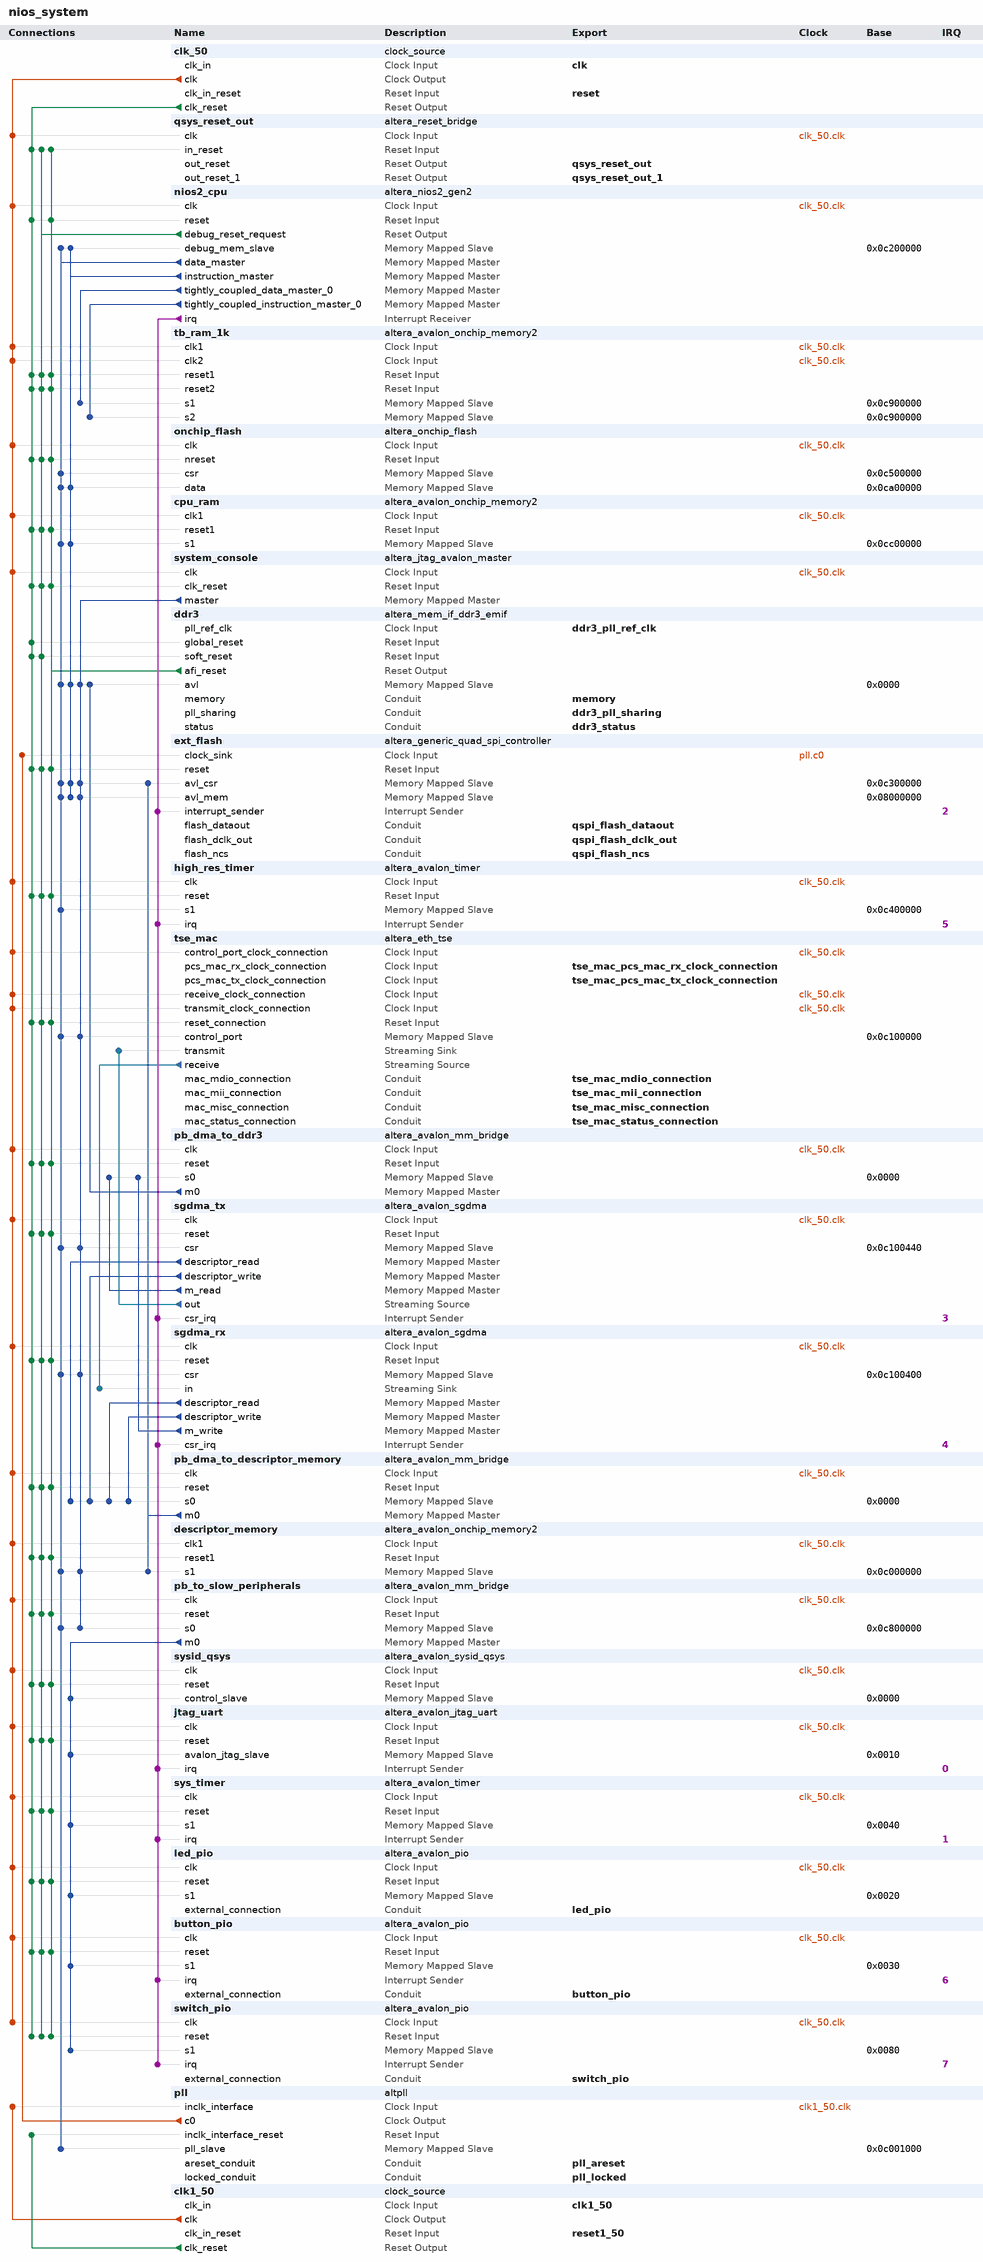
[diagram p0: system contents]
# Platform Designer (Qsys) system nios_system, MAX 10 10M50DAF484C6GES
# Parameters at their usual value, and those the tool derives, are not listed.
package require -exact qsys 16.0
create_system nios_system
set_project_property DEVICE_FAMILY {MAX 10}
set_project_property DEVICE 10M50DAF484C6GES

add_instance clk_50 clock_source 16.0
set_instance_parameter_value clk_50 clockFrequency 50000000

add_instance qsys_reset_out altera_reset_bridge 16.0
set_instance_parameter_value qsys_reset_out ACTIVE_LOW_RESET 1
set_instance_parameter_value qsys_reset_out NUM_RESET_OUTPUTS 2
set_instance_parameter_value qsys_reset_out SYNCHRONOUS_EDGES deassert

add_instance nios2_cpu altera_nios2_gen2 16.0
set_instance_parameter_value nios2_cpu dcache_numTCDM 1
set_instance_parameter_value nios2_cpu dcache_size 16384
set_instance_parameter_value nios2_cpu debug_datatrigger 2
set_instance_parameter_value nios2_cpu debug_hwbreakpoint 2
set_instance_parameter_value nios2_cpu debug_traceType instruction_and_data_trace
set_instance_parameter_value nios2_cpu dividerType srt2
set_instance_parameter_value nios2_cpu exceptionSlave ddr3.avl
set_instance_parameter_value nios2_cpu icache_numTCIM 1
set_instance_parameter_value nios2_cpu icache_size 32768
set_instance_parameter_value nios2_cpu impl Fast
set_instance_parameter_value nios2_cpu io_regionbase -536870912
set_instance_parameter_value nios2_cpu io_regionsize 536870912
set_instance_parameter_value nios2_cpu mmu_TLBMissExcOffset 256
set_instance_parameter_value nios2_cpu mmu_TLBMissExcSlave tb_ram_1k.s2
set_instance_parameter_value nios2_cpu mmu_enabled true
set_instance_parameter_value nios2_cpu resetSlave ext_flash.avl_mem
set_instance_parameter_value nios2_cpu setting_preciseIllegalMemAccessException true

add_instance tb_ram_1k altera_avalon_onchip_memory2 16.0
set_instance_parameter_value tb_ram_1k dataWidth 32
set_instance_parameter_value tb_ram_1k dualPort true
set_instance_parameter_value tb_ram_1k initMemContent false
set_instance_parameter_value tb_ram_1k initializationFileName onchip_mem.hex
set_instance_parameter_value tb_ram_1k memorySize 1024

add_instance onchip_flash altera_onchip_flash 16.0
set_instance_parameter_value onchip_flash CONFIGURATION_MODE {Single Compressed Image with Memory Initialization}
set_instance_parameter_value onchip_flash SECTOR_ACCESS_MODE {Read and write,Read and write,Hidden,Hidden,Hidden}
set_instance_parameter_value onchip_flash initFlashContent false
set_instance_parameter_value onchip_flash initializationFileName "C:\\Altera\\DevKits\\DECA_Max10\\Max10_ddr\\software\\an458_adv_boot_copier\\mem_init\\onchip_flash.hex"
set_instance_parameter_value onchip_flash useNonDefaultInitFile true

add_instance cpu_ram altera_avalon_onchip_memory2 16.0
set_instance_parameter_value cpu_ram dataWidth 32
set_instance_parameter_value cpu_ram dualPort false
set_instance_parameter_value cpu_ram initMemContent false
set_instance_parameter_value cpu_ram initializationFileName onchip_mem.hex
set_instance_parameter_value cpu_ram memorySize 49152

add_instance system_console altera_jtag_avalon_master 16.0

add_instance ddr3 altera_mem_if_ddr3_emif 16.0
set_instance_parameter_value ddr3 AVL_MAX_SIZE 4
set_instance_parameter_value ddr3 CALIBRATION_MODE Skip
set_instance_parameter_value ddr3 CPORT_TYPE_PORT Bidirectional,Bidirectional,Bidirectional,Bidirectional,Bidirectional,Bidirectional
set_instance_parameter_value ddr3 EXPORT_AFI_HALF_CLK false
set_instance_parameter_value ddr3 HARD_EMIF false
set_instance_parameter_value ddr3 MEM_BANKADDR_WIDTH 3
set_instance_parameter_value ddr3 MEM_CLK_FREQ 300.0
set_instance_parameter_value ddr3 MEM_CLK_FREQ_MAX 800.0
set_instance_parameter_value ddr3 MEM_COL_ADDR_WIDTH 10
set_instance_parameter_value ddr3 MEM_DQ_WIDTH 16
set_instance_parameter_value ddr3 MEM_FORMAT DISCRETE
set_instance_parameter_value ddr3 MEM_ROW_ADDR_WIDTH 13
set_instance_parameter_value ddr3 MEM_TCL 7
set_instance_parameter_value ddr3 MEM_TFAW_NS 45.0
set_instance_parameter_value ddr3 MEM_TRAS_NS 35.0
set_instance_parameter_value ddr3 MEM_TRCD_NS 13.75
set_instance_parameter_value ddr3 MEM_TRFC_NS 260.0
set_instance_parameter_value ddr3 MEM_TRP_NS 13.75
set_instance_parameter_value ddr3 MEM_TRRD_NS 7.5
set_instance_parameter_value ddr3 MEM_TRTP_NS 7.5
set_instance_parameter_value ddr3 MEM_TWTR 6
set_instance_parameter_value ddr3 MEM_VENDOR Micron
set_instance_parameter_value ddr3 MEM_VERBOSE false
set_instance_parameter_value ddr3 MEM_WTCL 6
set_instance_parameter_value ddr3 PLL_LOCATION Top_Bottom
set_instance_parameter_value ddr3 POWER_OF_TWO_BUS true
set_instance_parameter_value ddr3 PRIORITY_PORT 1,1,1,1,1,1
set_instance_parameter_value ddr3 RATE Half
set_instance_parameter_value ddr3 REF_CLK_FREQ 50.0
set_instance_parameter_value ddr3 SPEED_GRADE 6
set_instance_parameter_value ddr3 TIMING_BOARD_AC_SKEW 0.017
set_instance_parameter_value ddr3 TIMING_BOARD_AC_TO_CK_SKEW -1.3E-4
set_instance_parameter_value ddr3 TIMING_BOARD_DQ_TO_DQS_SKEW -6.0E-4
set_instance_parameter_value ddr3 TIMING_BOARD_MAX_CK_DELAY 0.183
set_instance_parameter_value ddr3 TIMING_BOARD_MAX_DQS_DELAY 0.181
set_instance_parameter_value ddr3 TIMING_BOARD_SKEW_BETWEEN_DQS 0.005
set_instance_parameter_value ddr3 TIMING_BOARD_SKEW_CKDQS_DIMM_MAX 0.007
set_instance_parameter_value ddr3 TIMING_BOARD_SKEW_CKDQS_DIMM_MIN 0.002
set_instance_parameter_value ddr3 TIMING_BOARD_SKEW_WITHIN_DQS 0.008
set_instance_parameter_value ddr3 TIMING_TDH 55
set_instance_parameter_value ddr3 TIMING_TDQSCK 225
set_instance_parameter_value ddr3 TIMING_TDQSQ 125
set_instance_parameter_value ddr3 TIMING_TDQSS 0.25
set_instance_parameter_value ddr3 TIMING_TDS 55
set_instance_parameter_value ddr3 TIMING_TDSH 0.2
set_instance_parameter_value ddr3 TIMING_TDSS 0.2
set_instance_parameter_value ddr3 TIMING_TIH 130
set_instance_parameter_value ddr3 TIMING_TIS 185
set_instance_parameter_value ddr3 TIMING_TQSH 0.4
set_instance_parameter_value ddr3 USER_DEBUG_LEVEL 1

add_instance ext_flash altera_generic_quad_spi_controller 16.0
set_instance_parameter_value ext_flash CHIP_SELS 1
set_instance_parameter_value ext_flash FLASH_TYPE Micron512
set_instance_parameter_value ext_flash IO_MODE QUAD
set_instance_parameter_value ext_flash clkFreq 25000000

add_instance high_res_timer altera_avalon_timer 16.0
set_instance_parameter_value high_res_timer period 1
set_instance_parameter_value high_res_timer periodUnits USEC

add_instance tse_mac altera_eth_tse 16.0
set_instance_parameter_value tse_mac core_variation SMALL_MAC_10_100
set_instance_parameter_value tse_mac enable_hd_logic true
set_instance_parameter_value tse_mac enable_mac_flow_ctrl false
set_instance_parameter_value tse_mac enable_magic_detect false
set_instance_parameter_value tse_mac enable_shift16 true
set_instance_parameter_value tse_mac ifGMII MII
set_instance_parameter_value tse_mac ing_addr 11
set_instance_parameter_value tse_mac mdio_clk_div 40
set_instance_parameter_value tse_mac stat_cnt_ena false
set_instance_parameter_value tse_mac transceiver_type NONE

add_instance pb_dma_to_ddr3 altera_avalon_mm_bridge 16.0
set_instance_parameter_value pb_dma_to_ddr3 ADDRESS_UNITS SYMBOLS
set_instance_parameter_value pb_dma_to_ddr3 ADDRESS_WIDTH 28
set_instance_parameter_value pb_dma_to_ddr3 DATA_WIDTH 32
set_instance_parameter_value pb_dma_to_ddr3 MAX_PENDING_RESPONSES 4
set_instance_parameter_value pb_dma_to_ddr3 USE_AUTO_ADDRESS_WIDTH 0

add_instance sgdma_tx altera_avalon_sgdma 16.0
set_instance_parameter_value sgdma_tx enableBurstTransfers false
set_instance_parameter_value sgdma_tx enableUnalignedTransfers true
set_instance_parameter_value sgdma_tx readBlockDataWidth 32
set_instance_parameter_value sgdma_tx sinkErrorWidth 0
set_instance_parameter_value sgdma_tx sourceErrorWidth 1
set_instance_parameter_value sgdma_tx transferMode MEMORY_TO_STREAM
set_instance_parameter_value sgdma_tx writeBurstcountWidth 4

add_instance sgdma_rx altera_avalon_sgdma 16.0
set_instance_parameter_value sgdma_rx enableBurstTransfers false
set_instance_parameter_value sgdma_rx enableUnalignedTransfers true
set_instance_parameter_value sgdma_rx readBlockDataWidth 32
set_instance_parameter_value sgdma_rx sinkErrorWidth 6
set_instance_parameter_value sgdma_rx sourceErrorWidth 0
set_instance_parameter_value sgdma_rx transferMode STREAM_TO_MEMORY
set_instance_parameter_value sgdma_rx writeBurstcountWidth 4

add_instance pb_dma_to_descriptor_memory altera_avalon_mm_bridge 16.0
set_instance_parameter_value pb_dma_to_descriptor_memory ADDRESS_UNITS SYMBOLS
set_instance_parameter_value pb_dma_to_descriptor_memory ADDRESS_WIDTH 31
set_instance_parameter_value pb_dma_to_descriptor_memory DATA_WIDTH 32
set_instance_parameter_value pb_dma_to_descriptor_memory MAX_PENDING_RESPONSES 4
set_instance_parameter_value pb_dma_to_descriptor_memory USE_AUTO_ADDRESS_WIDTH 0

add_instance descriptor_memory altera_avalon_onchip_memory2 16.0
set_instance_parameter_value descriptor_memory dataWidth 32
set_instance_parameter_value descriptor_memory dualPort false
set_instance_parameter_value descriptor_memory initMemContent false
set_instance_parameter_value descriptor_memory initializationFileName onchip_mem.hex
set_instance_parameter_value descriptor_memory memorySize 4096

add_instance pb_to_slow_peripherals altera_avalon_mm_bridge 16.0
set_instance_parameter_value pb_to_slow_peripherals ADDRESS_UNITS SYMBOLS
set_instance_parameter_value pb_to_slow_peripherals ADDRESS_WIDTH 12
set_instance_parameter_value pb_to_slow_peripherals DATA_WIDTH 32
set_instance_parameter_value pb_to_slow_peripherals MAX_PENDING_RESPONSES 4
set_instance_parameter_value pb_to_slow_peripherals USE_AUTO_ADDRESS_WIDTH 0

add_instance sysid_qsys altera_avalon_sysid_qsys 16.0
set_instance_parameter_value sysid_qsys id 57034

add_instance jtag_uart altera_avalon_jtag_uart 16.0
set_instance_parameter_value jtag_uart simInteractiveOptions NO_INTERACTIVE_WINDOWS

add_instance sys_timer altera_avalon_timer 16.0
set_instance_parameter_value sys_timer period 1
set_instance_parameter_value sys_timer periodUnits MSEC

add_instance led_pio altera_avalon_pio 16.0
set_instance_parameter_value led_pio direction Output
set_instance_parameter_value led_pio width 8

add_instance button_pio altera_avalon_pio 16.0
set_instance_parameter_value button_pio bitClearingEdgeCapReg true
set_instance_parameter_value button_pio captureEdge true
set_instance_parameter_value button_pio direction Input
set_instance_parameter_value button_pio generateIRQ true
set_instance_parameter_value button_pio irqType EDGE
set_instance_parameter_value button_pio simDoTestBenchWiring true
set_instance_parameter_value button_pio width 8

add_instance switch_pio altera_avalon_pio 16.0
set_instance_parameter_value switch_pio bitClearingEdgeCapReg true
set_instance_parameter_value switch_pio captureEdge true
set_instance_parameter_value switch_pio direction Input
set_instance_parameter_value switch_pio generateIRQ true
set_instance_parameter_value switch_pio irqType EDGE
set_instance_parameter_value switch_pio simDoTestBenchWiring true
set_instance_parameter_value switch_pio width 8

add_instance pll altpll 16.0
set_instance_parameter_value pll CLK0_DIVIDE_BY 2
set_instance_parameter_value pll CLK0_MULTIPLY_BY 1
set_instance_parameter_value pll INCLK0_INPUT_FREQUENCY 20000
set_instance_parameter_value pll PORT_ARESET PORT_USED
set_instance_parameter_value pll PORT_LOCKED PORT_USED
set_instance_parameter_value pll PORT_clk1 PORT_UNUSED
set_instance_parameter_value pll PORT_clk2 PORT_UNUSED
set_instance_parameter_value pll PORT_clk3 PORT_UNUSED

add_instance clk1_50 clock_source 16.0
set_instance_parameter_value clk1_50 clockFrequency 50000000

# connections
add_connection clk1_50.clk pll.inclk_interface clock
add_connection clk_50.clk button_pio.clk clock
add_connection clk_50.clk cpu_ram.clk1 clock
add_connection clk_50.clk descriptor_memory.clk1 clock
add_connection clk_50.clk high_res_timer.clk clock
add_connection clk_50.clk jtag_uart.clk clock
add_connection clk_50.clk led_pio.clk clock
add_connection clk_50.clk nios2_cpu.clk clock
add_connection clk_50.clk onchip_flash.clk clock
add_connection clk_50.clk pb_dma_to_ddr3.clk clock
add_connection clk_50.clk pb_dma_to_descriptor_memory.clk clock
add_connection clk_50.clk pb_to_slow_peripherals.clk clock
add_connection clk_50.clk qsys_reset_out.clk clock
add_connection clk_50.clk sgdma_rx.clk clock
add_connection clk_50.clk sgdma_tx.clk clock
add_connection clk_50.clk switch_pio.clk clock
add_connection clk_50.clk sys_timer.clk clock
add_connection clk_50.clk sysid_qsys.clk clock
add_connection clk_50.clk system_console.clk clock
add_connection clk_50.clk tb_ram_1k.clk1 clock
add_connection clk_50.clk tb_ram_1k.clk2 clock
add_connection clk_50.clk tse_mac.control_port_clock_connection clock
add_connection clk_50.clk tse_mac.receive_clock_connection clock
add_connection clk_50.clk tse_mac.transmit_clock_connection clock
add_connection pll.c0 ext_flash.clock_sink clock
add_connection clk1_50.clk_reset pll.inclk_interface_reset reset
add_connection clk_50.clk_reset button_pio.reset reset
add_connection clk_50.clk_reset cpu_ram.reset1 reset
add_connection clk_50.clk_reset ddr3.global_reset reset
add_connection clk_50.clk_reset ddr3.soft_reset reset
add_connection clk_50.clk_reset descriptor_memory.reset1 reset
add_connection clk_50.clk_reset ext_flash.reset reset
add_connection clk_50.clk_reset high_res_timer.reset reset
add_connection clk_50.clk_reset jtag_uart.reset reset
add_connection clk_50.clk_reset led_pio.reset reset
add_connection clk_50.clk_reset nios2_cpu.reset reset
add_connection clk_50.clk_reset onchip_flash.nreset reset
add_connection clk_50.clk_reset pb_dma_to_ddr3.reset reset
add_connection clk_50.clk_reset pb_dma_to_descriptor_memory.reset reset
add_connection clk_50.clk_reset pb_to_slow_peripherals.reset reset
add_connection clk_50.clk_reset qsys_reset_out.in_reset reset
add_connection clk_50.clk_reset sgdma_rx.reset reset
add_connection clk_50.clk_reset sgdma_tx.reset reset
add_connection clk_50.clk_reset switch_pio.reset reset
add_connection clk_50.clk_reset sys_timer.reset reset
add_connection clk_50.clk_reset sysid_qsys.reset reset
add_connection clk_50.clk_reset system_console.clk_reset reset
add_connection clk_50.clk_reset tb_ram_1k.reset1 reset
add_connection clk_50.clk_reset tb_ram_1k.reset2 reset
add_connection clk_50.clk_reset tse_mac.reset_connection reset
add_connection ddr3.afi_reset button_pio.reset reset
add_connection ddr3.afi_reset cpu_ram.reset1 reset
add_connection ddr3.afi_reset descriptor_memory.reset1 reset
add_connection ddr3.afi_reset ext_flash.reset reset
add_connection ddr3.afi_reset high_res_timer.reset reset
add_connection ddr3.afi_reset jtag_uart.reset reset
add_connection ddr3.afi_reset led_pio.reset reset
add_connection ddr3.afi_reset nios2_cpu.reset reset
add_connection ddr3.afi_reset onchip_flash.nreset reset
add_connection ddr3.afi_reset pb_dma_to_ddr3.reset reset
add_connection ddr3.afi_reset pb_dma_to_descriptor_memory.reset reset
add_connection ddr3.afi_reset pb_to_slow_peripherals.reset reset
add_connection ddr3.afi_reset qsys_reset_out.in_reset reset
add_connection ddr3.afi_reset sgdma_rx.reset reset
add_connection ddr3.afi_reset sgdma_tx.reset reset
add_connection ddr3.afi_reset switch_pio.reset reset
add_connection ddr3.afi_reset sys_timer.reset reset
add_connection ddr3.afi_reset sysid_qsys.reset reset
add_connection ddr3.afi_reset system_console.clk_reset reset
add_connection ddr3.afi_reset tb_ram_1k.reset1 reset
add_connection ddr3.afi_reset tb_ram_1k.reset2 reset
add_connection ddr3.afi_reset tse_mac.reset_connection reset
add_connection nios2_cpu.debug_reset_request button_pio.reset reset
add_connection nios2_cpu.debug_reset_request cpu_ram.reset1 reset
add_connection nios2_cpu.debug_reset_request ddr3.soft_reset reset
add_connection nios2_cpu.debug_reset_request descriptor_memory.reset1 reset
add_connection nios2_cpu.debug_reset_request ext_flash.reset reset
add_connection nios2_cpu.debug_reset_request high_res_timer.reset reset
add_connection nios2_cpu.debug_reset_request jtag_uart.reset reset
add_connection nios2_cpu.debug_reset_request led_pio.reset reset
add_connection nios2_cpu.debug_reset_request onchip_flash.nreset reset
add_connection nios2_cpu.debug_reset_request pb_dma_to_ddr3.reset reset
add_connection nios2_cpu.debug_reset_request pb_dma_to_descriptor_memory.reset reset
add_connection nios2_cpu.debug_reset_request pb_to_slow_peripherals.reset reset
add_connection nios2_cpu.debug_reset_request qsys_reset_out.in_reset reset
add_connection nios2_cpu.debug_reset_request sgdma_rx.reset reset
add_connection nios2_cpu.debug_reset_request sgdma_tx.reset reset
add_connection nios2_cpu.debug_reset_request switch_pio.reset reset
add_connection nios2_cpu.debug_reset_request sys_timer.reset reset
add_connection nios2_cpu.debug_reset_request sysid_qsys.reset reset
add_connection nios2_cpu.debug_reset_request system_console.clk_reset reset
add_connection nios2_cpu.debug_reset_request tb_ram_1k.reset1 reset
add_connection nios2_cpu.debug_reset_request tb_ram_1k.reset2 reset
add_connection nios2_cpu.debug_reset_request tse_mac.reset_connection reset
add_connection nios2_cpu.data_master cpu_ram.s1 avalon
set_connection_parameter_value nios2_cpu.data_master/cpu_ram.s1 baseAddress 0x0cc00000
add_connection nios2_cpu.data_master ddr3.avl avalon
set_connection_parameter_value nios2_cpu.data_master/ddr3.avl baseAddress 0x0000
add_connection nios2_cpu.data_master descriptor_memory.s1 avalon
set_connection_parameter_value nios2_cpu.data_master/descriptor_memory.s1 baseAddress 0x0c000000
add_connection nios2_cpu.data_master ext_flash.avl_csr avalon
set_connection_parameter_value nios2_cpu.data_master/ext_flash.avl_csr baseAddress 0x0c300000
add_connection nios2_cpu.data_master ext_flash.avl_mem avalon
set_connection_parameter_value nios2_cpu.data_master/ext_flash.avl_mem baseAddress 0x08000000
add_connection nios2_cpu.data_master high_res_timer.s1 avalon
set_connection_parameter_value nios2_cpu.data_master/high_res_timer.s1 baseAddress 0x0c400000
add_connection nios2_cpu.data_master nios2_cpu.debug_mem_slave avalon
set_connection_parameter_value nios2_cpu.data_master/nios2_cpu.debug_mem_slave baseAddress 0x0c200000
add_connection nios2_cpu.data_master onchip_flash.csr avalon
set_connection_parameter_value nios2_cpu.data_master/onchip_flash.csr baseAddress 0x0c500000
add_connection nios2_cpu.data_master onchip_flash.data avalon
set_connection_parameter_value nios2_cpu.data_master/onchip_flash.data baseAddress 0x0ca00000
add_connection nios2_cpu.data_master pb_to_slow_peripherals.s0 avalon
set_connection_parameter_value nios2_cpu.data_master/pb_to_slow_peripherals.s0 baseAddress 0x0c800000
add_connection nios2_cpu.data_master pll.pll_slave avalon
set_connection_parameter_value nios2_cpu.data_master/pll.pll_slave baseAddress 0x0c001000
add_connection nios2_cpu.data_master sgdma_rx.csr avalon
set_connection_parameter_value nios2_cpu.data_master/sgdma_rx.csr baseAddress 0x0c100400
add_connection nios2_cpu.data_master sgdma_tx.csr avalon
set_connection_parameter_value nios2_cpu.data_master/sgdma_tx.csr baseAddress 0x0c100440
add_connection nios2_cpu.data_master tse_mac.control_port avalon
set_connection_parameter_value nios2_cpu.data_master/tse_mac.control_port baseAddress 0x0c100000
add_connection nios2_cpu.instruction_master cpu_ram.s1 avalon
set_connection_parameter_value nios2_cpu.instruction_master/cpu_ram.s1 baseAddress 0x0cc00000
add_connection nios2_cpu.instruction_master ddr3.avl avalon
set_connection_parameter_value nios2_cpu.instruction_master/ddr3.avl baseAddress 0x0000
add_connection nios2_cpu.instruction_master ext_flash.avl_csr avalon
set_connection_parameter_value nios2_cpu.instruction_master/ext_flash.avl_csr baseAddress 0x0c300000
add_connection nios2_cpu.instruction_master ext_flash.avl_mem avalon
set_connection_parameter_value nios2_cpu.instruction_master/ext_flash.avl_mem baseAddress 0x08000000
add_connection nios2_cpu.instruction_master nios2_cpu.debug_mem_slave avalon
set_connection_parameter_value nios2_cpu.instruction_master/nios2_cpu.debug_mem_slave baseAddress 0x0c200000
add_connection nios2_cpu.instruction_master onchip_flash.data avalon
set_connection_parameter_value nios2_cpu.instruction_master/onchip_flash.data baseAddress 0x0ca00000
add_connection nios2_cpu.tightly_coupled_data_master_0 tb_ram_1k.s1 avalon
set_connection_parameter_value nios2_cpu.tightly_coupled_data_master_0/tb_ram_1k.s1 baseAddress 0x0c900000
add_connection nios2_cpu.tightly_coupled_instruction_master_0 tb_ram_1k.s2 avalon
set_connection_parameter_value nios2_cpu.tightly_coupled_instruction_master_0/tb_ram_1k.s2 baseAddress 0x0c900000
add_connection pb_dma_to_ddr3.m0 ddr3.avl avalon
set_connection_parameter_value pb_dma_to_ddr3.m0/ddr3.avl baseAddress 0x0000
add_connection pb_dma_to_descriptor_memory.m0 descriptor_memory.s1 avalon
set_connection_parameter_value pb_dma_to_descriptor_memory.m0/descriptor_memory.s1 baseAddress 0x0c000000
add_connection pb_dma_to_descriptor_memory.m0 ext_flash.avl_csr avalon
set_connection_parameter_value pb_dma_to_descriptor_memory.m0/ext_flash.avl_csr baseAddress 0x0c300000
add_connection pb_to_slow_peripherals.m0 button_pio.s1 avalon
set_connection_parameter_value pb_to_slow_peripherals.m0/button_pio.s1 baseAddress 0x0030
add_connection pb_to_slow_peripherals.m0 jtag_uart.avalon_jtag_slave avalon
set_connection_parameter_value pb_to_slow_peripherals.m0/jtag_uart.avalon_jtag_slave baseAddress 0x0010
add_connection pb_to_slow_peripherals.m0 led_pio.s1 avalon
set_connection_parameter_value pb_to_slow_peripherals.m0/led_pio.s1 baseAddress 0x0020
add_connection pb_to_slow_peripherals.m0 switch_pio.s1 avalon
set_connection_parameter_value pb_to_slow_peripherals.m0/switch_pio.s1 baseAddress 0x0080
add_connection pb_to_slow_peripherals.m0 sys_timer.s1 avalon
set_connection_parameter_value pb_to_slow_peripherals.m0/sys_timer.s1 baseAddress 0x0040
add_connection pb_to_slow_peripherals.m0 sysid_qsys.control_slave avalon
set_connection_parameter_value pb_to_slow_peripherals.m0/sysid_qsys.control_slave baseAddress 0x0000
add_connection sgdma_rx.descriptor_read pb_dma_to_descriptor_memory.s0 avalon
set_connection_parameter_value sgdma_rx.descriptor_read/pb_dma_to_descriptor_memory.s0 baseAddress 0x0000
add_connection sgdma_rx.descriptor_write pb_dma_to_descriptor_memory.s0 avalon
set_connection_parameter_value sgdma_rx.descriptor_write/pb_dma_to_descriptor_memory.s0 baseAddress 0x0000
add_connection sgdma_rx.m_write pb_dma_to_ddr3.s0 avalon
set_connection_parameter_value sgdma_rx.m_write/pb_dma_to_ddr3.s0 baseAddress 0x0000
add_connection sgdma_tx.descriptor_read pb_dma_to_descriptor_memory.s0 avalon
set_connection_parameter_value sgdma_tx.descriptor_read/pb_dma_to_descriptor_memory.s0 baseAddress 0x0000
add_connection sgdma_tx.descriptor_write pb_dma_to_descriptor_memory.s0 avalon
set_connection_parameter_value sgdma_tx.descriptor_write/pb_dma_to_descriptor_memory.s0 baseAddress 0x0000
add_connection sgdma_tx.m_read pb_dma_to_ddr3.s0 avalon
set_connection_parameter_value sgdma_tx.m_read/pb_dma_to_ddr3.s0 baseAddress 0x0000
add_connection system_console.master ddr3.avl avalon
set_connection_parameter_value system_console.master/ddr3.avl baseAddress 0x0000
add_connection system_console.master descriptor_memory.s1 avalon
set_connection_parameter_value system_console.master/descriptor_memory.s1 baseAddress 0x0c000000
add_connection system_console.master ext_flash.avl_csr avalon
set_connection_parameter_value system_console.master/ext_flash.avl_csr baseAddress 0x0c300000
add_connection system_console.master ext_flash.avl_mem avalon
set_connection_parameter_value system_console.master/ext_flash.avl_mem baseAddress 0x08000000
add_connection system_console.master pb_to_slow_peripherals.s0 avalon
set_connection_parameter_value system_console.master/pb_to_slow_peripherals.s0 baseAddress 0x0c800000
add_connection system_console.master sgdma_rx.csr avalon
set_connection_parameter_value system_console.master/sgdma_rx.csr baseAddress 0x0c100400
add_connection system_console.master sgdma_tx.csr avalon
set_connection_parameter_value system_console.master/sgdma_tx.csr baseAddress 0x0c100440
add_connection system_console.master tse_mac.control_port avalon
set_connection_parameter_value system_console.master/tse_mac.control_port baseAddress 0x0c100000
add_connection sgdma_tx.out tse_mac.transmit avalon_streaming
add_connection tse_mac.receive sgdma_rx.in avalon_streaming
add_connection nios2_cpu.irq button_pio.irq interrupt
set_connection_parameter_value nios2_cpu.irq/button_pio.irq irqNumber 6
add_connection nios2_cpu.irq ext_flash.interrupt_sender interrupt
set_connection_parameter_value nios2_cpu.irq/ext_flash.interrupt_sender irqNumber 2
add_connection nios2_cpu.irq high_res_timer.irq interrupt
set_connection_parameter_value nios2_cpu.irq/high_res_timer.irq irqNumber 5
add_connection nios2_cpu.irq jtag_uart.irq interrupt
set_connection_parameter_value nios2_cpu.irq/jtag_uart.irq irqNumber 0
add_connection nios2_cpu.irq sgdma_rx.csr_irq interrupt
set_connection_parameter_value nios2_cpu.irq/sgdma_rx.csr_irq irqNumber 4
add_connection nios2_cpu.irq sgdma_tx.csr_irq interrupt
set_connection_parameter_value nios2_cpu.irq/sgdma_tx.csr_irq irqNumber 3
add_connection nios2_cpu.irq switch_pio.irq interrupt
set_connection_parameter_value nios2_cpu.irq/switch_pio.irq irqNumber 7
add_connection nios2_cpu.irq sys_timer.irq interrupt
set_connection_parameter_value nios2_cpu.irq/sys_timer.irq irqNumber 1

# exported interfaces
add_interface button_pio conduit end
set_interface_property button_pio EXPORT_OF button_pio.external_connection
add_interface clk clock sink
set_interface_property clk EXPORT_OF clk_50.clk_in
add_interface clk1_50 clock sink
set_interface_property clk1_50 EXPORT_OF clk1_50.clk_in
add_interface ddr3_pll_ref_clk clock sink
set_interface_property ddr3_pll_ref_clk EXPORT_OF ddr3.pll_ref_clk
add_interface ddr3_pll_sharing conduit end
set_interface_property ddr3_pll_sharing EXPORT_OF ddr3.pll_sharing
add_interface ddr3_status conduit end
set_interface_property ddr3_status EXPORT_OF ddr3.status
add_interface led_pio conduit end
set_interface_property led_pio EXPORT_OF led_pio.external_connection
add_interface memory conduit end
set_interface_property memory EXPORT_OF ddr3.memory
add_interface pll_areset conduit end
set_interface_property pll_areset EXPORT_OF pll.areset_conduit
add_interface pll_locked conduit end
set_interface_property pll_locked EXPORT_OF pll.locked_conduit
add_interface qspi_flash_dataout conduit end
set_interface_property qspi_flash_dataout EXPORT_OF ext_flash.flash_dataout
add_interface qspi_flash_dclk_out conduit end
set_interface_property qspi_flash_dclk_out EXPORT_OF ext_flash.flash_dclk_out
add_interface qspi_flash_ncs conduit end
set_interface_property qspi_flash_ncs EXPORT_OF ext_flash.flash_ncs
add_interface qsys_reset_out reset source
set_interface_property qsys_reset_out EXPORT_OF qsys_reset_out.out_reset
add_interface qsys_reset_out_1 reset source
set_interface_property qsys_reset_out_1 EXPORT_OF qsys_reset_out.out_reset_1
add_interface reset reset sink
set_interface_property reset EXPORT_OF clk_50.clk_in_reset
add_interface reset1_50 reset sink
set_interface_property reset1_50 EXPORT_OF clk1_50.clk_in_reset
add_interface switch_pio conduit end
set_interface_property switch_pio EXPORT_OF switch_pio.external_connection
add_interface tse_mac_mdio_connection conduit end
set_interface_property tse_mac_mdio_connection EXPORT_OF tse_mac.mac_mdio_connection
add_interface tse_mac_mii_connection conduit end
set_interface_property tse_mac_mii_connection EXPORT_OF tse_mac.mac_mii_connection
add_interface tse_mac_misc_connection conduit end
set_interface_property tse_mac_misc_connection EXPORT_OF tse_mac.mac_misc_connection
add_interface tse_mac_pcs_mac_rx_clock_connection clock sink
set_interface_property tse_mac_pcs_mac_rx_clock_connection EXPORT_OF tse_mac.pcs_mac_rx_clock_connection
add_interface tse_mac_pcs_mac_tx_clock_connection clock sink
set_interface_property tse_mac_pcs_mac_tx_clock_connection EXPORT_OF tse_mac.pcs_mac_tx_clock_connection
add_interface tse_mac_status_connection conduit end
set_interface_property tse_mac_status_connection EXPORT_OF tse_mac.mac_status_connection

set_interconnect_requirement {$system} qsys_mm.clockCrossingAdapter FIFO
set_interconnect_requirement {$system} qsys_mm.insertDefaultSlave FALSE
set_interconnect_requirement {$system} qsys_mm.maxAdditionalLatency 4

save_system nios_system.qsys
